# Altium schematic sheet TopLevel.SchDoc: Top Level
size A3; Organization: ORGANIZATION; Address1: ADDRESS 1; Address2: ADDRESS 2; Address3: ADDRESS 3; Address4: ADDRESS 4; Revision: -; SheetNumber: 1; SheetTotal: 11; ENG_APP_DATE: --/--/--; DSN_APP_DATE: --/--/--; CHK_APP_DATE: --/--/--
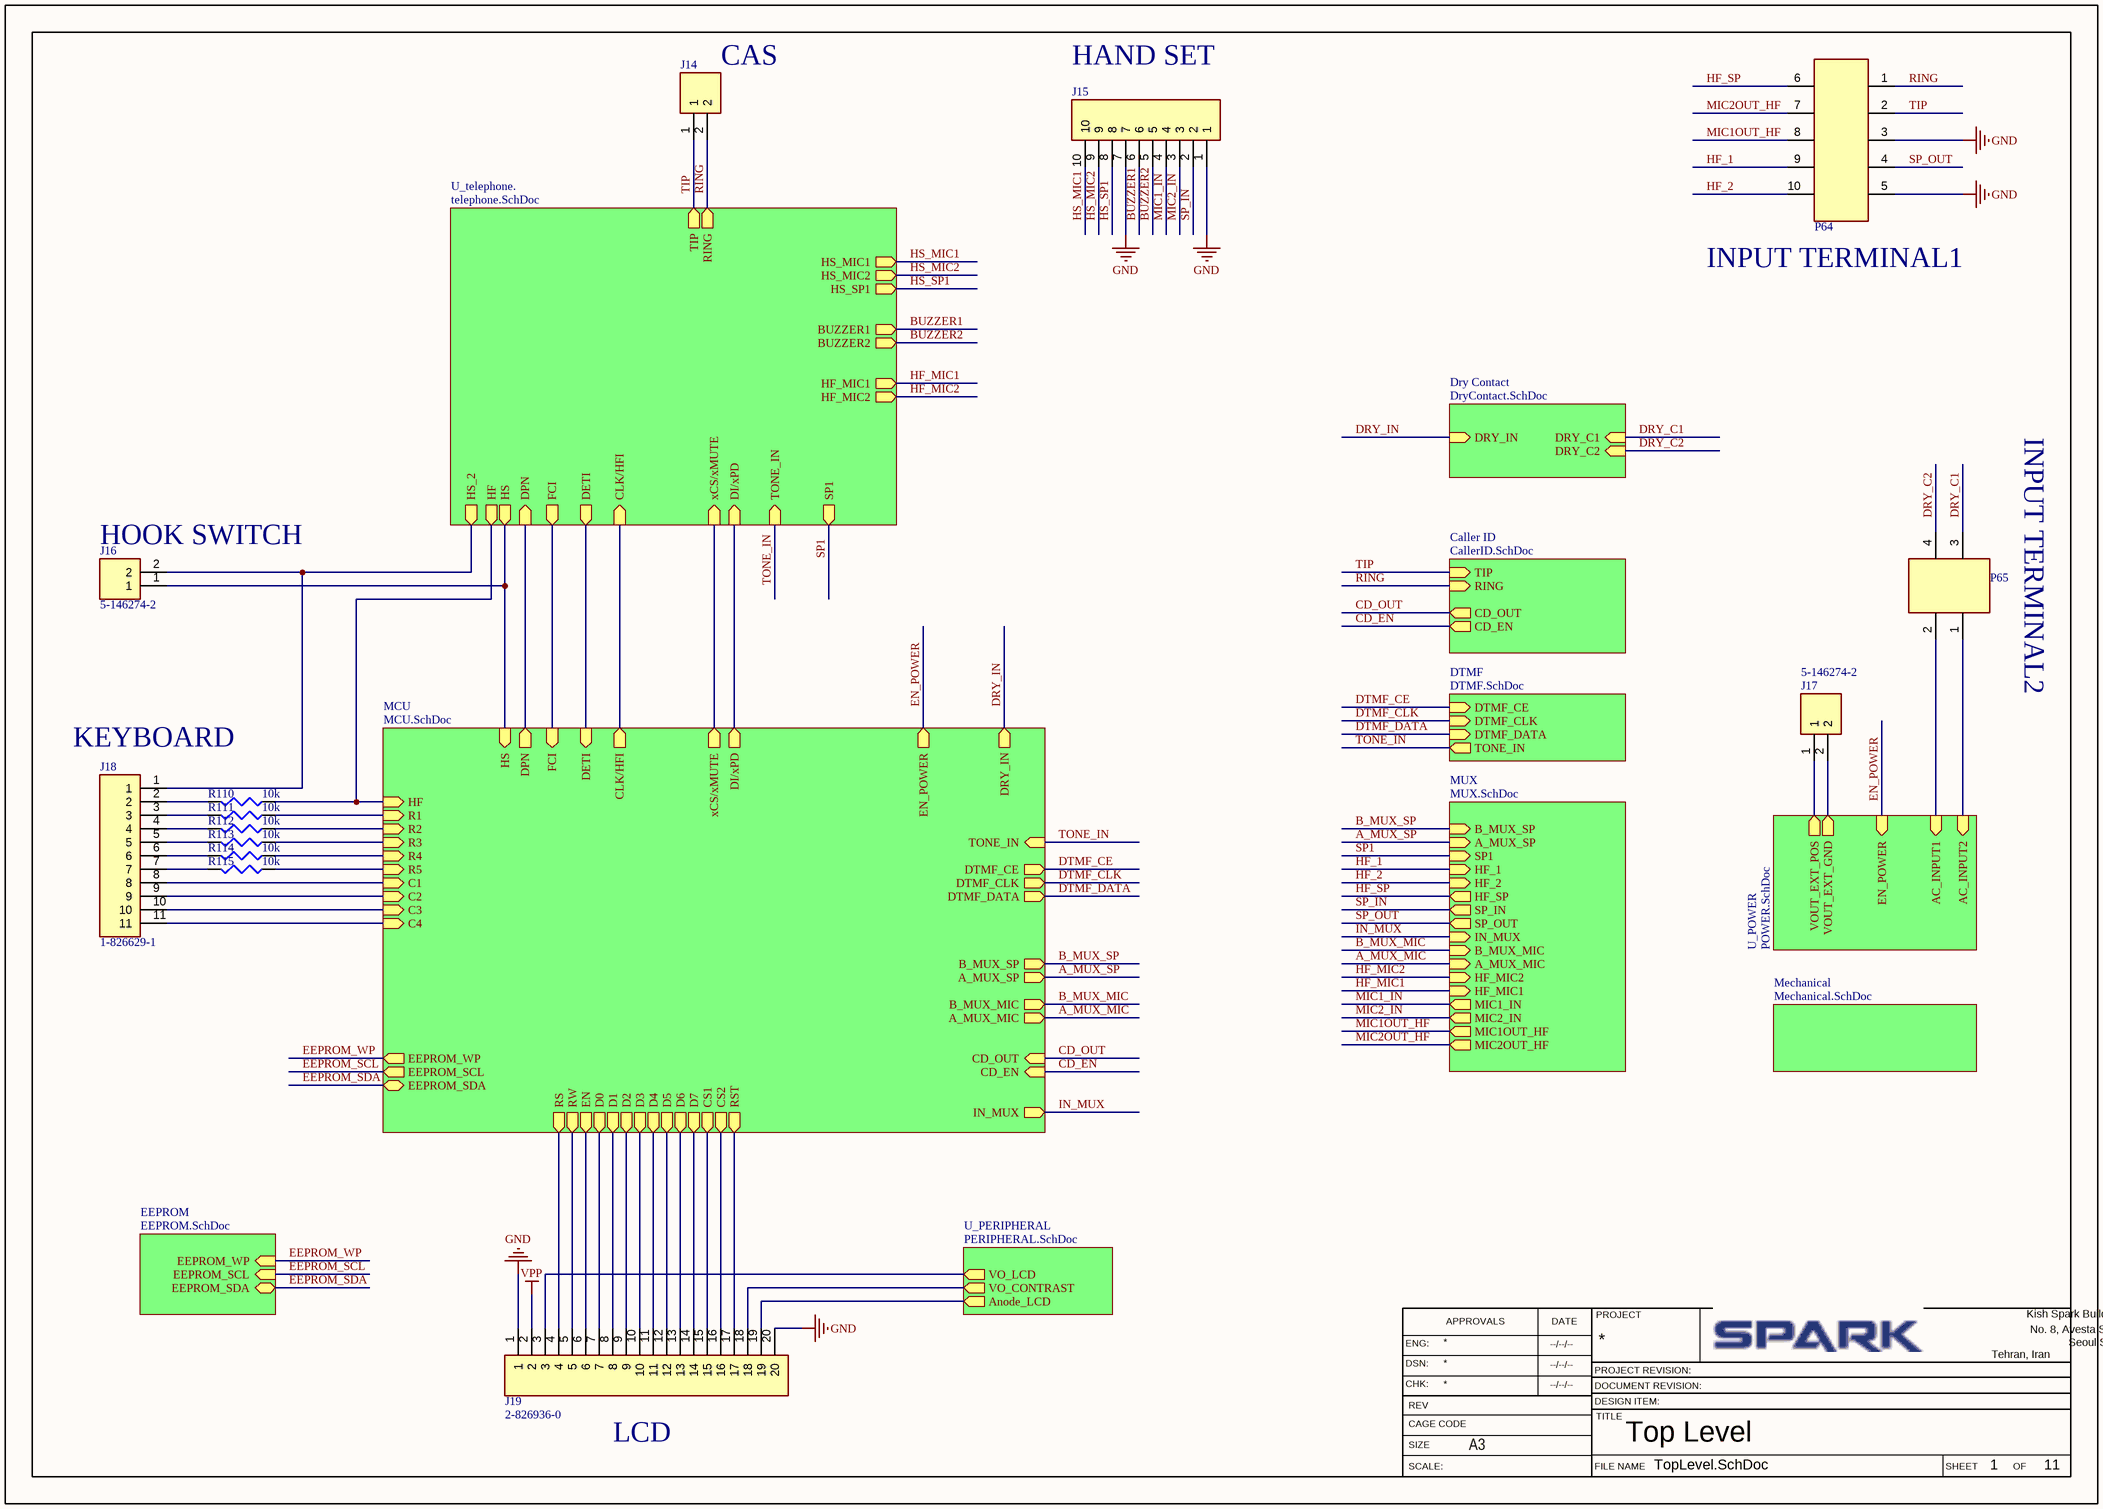
[diagram p0: TopLevel.SchDoc]

## Parts
J14  5-146274-2  [TE_5-146274-2]  (value not drawn)
J15  146443-5  [146443-5]  (value not drawn)
J16  5-146274-2  [TE_5-146274-2]
J17  5-146274-2  [TE_5-146274-2]
J18  1-826629-1  [1-826629-1]
J19  2-826936-0  [2-826936-0]
P64  66201021122  [POWER 10 PIN]  (value not drawn)
P65  66200421122  [power-4pin]  (value not drawn)
R110  value 10k  [R0603]  (hidden comment: CRCW060310K0JNEA)
R111  value 10k  [R0603]  (hidden comment: CRCW060310K0JNEA)
R112  value 10k  [R0603]  (hidden comment: CRCW060310K0JNEA)
R113  value 10k  [R0603]  (hidden comment: CRCW060310K0JNEA)
R114  value 10k  [R0603]  (hidden comment: CRCW060310K0JNEA)
R115  value 10k  [R0603]  (hidden comment: CRCW060310K0JNEA)

## Sub-sheets
Caller ID = CallerID.SchDoc: CD_OUT (out), TIP (in), RING (in), CD_EN (out)
Dry Contact = DryContact.SchDoc: DRY_C2 (in), DRY_C1 (in), DRY_IN (in)
DTMF = DTMF.SchDoc: DTMF_CE (in), DTMF_CLK (in), DTMF_DATA (in), TONE_IN (out)
EEPROM = EEPROM.SchDoc: EEPROM_WP (in), EEPROM_SCL (in), EEPROM_SDA (bidir)
MCU = MCU.SchDoc: DI/xPD (out), xCS/xMUTE (out), DPN (out), CLK/HFI (out), DETI (in), DTMF_CE (out), DTMF_CLK (out), DTMF_DATA (out), TONE_IN (in), R1 (in), R2 (in), R3 (in), R4 (in), R5 (in), C1 (in), C2 (in), C3 (in), C4 (in), HF (in), HS (in), FCI (in), B_MUX_SP (out), A_MUX_SP (out), B_MUX_MIC (out), A_MUX_MIC (out), CD_EN (in), CD_OUT (in), CS2 (out), D4 (out), D5 (out), EN (out), D6 (out), D2 (out), CS1 (out), D3 (out), D1 (out), RS (out), D0 (out), RST (out), D7 (out), RW (out), DRY_IN (out), EN_POWER (out), IN_MUX (out), EEPROM_WP (out), EEPROM_SCL (out), EEPROM_SDA (bidir)
Mechanical = Mechanical.SchDoc: no entries
MUX = MUX.SchDoc: B_MUX_SP (in), A_MUX_SP (in), SP1 (in), HF_1 (in), HF_2 (in), HF_SP (out), SP_IN (out), SP_OUT (out), IN_MUX (in), B_MUX_MIC (in), A_MUX_MIC (in), HF_MIC2 (in), HF_MIC1 (in), MIC1_IN (out), MIC2_IN (out), MIC1OUT_HF (out), MIC2OUT_HF (out)
U_PERIPHERAL = PERIPHERAL.SchDoc: VO_LCD (out), VO_CONTRAST (out), Anode_LCD (out)
U_POWER = POWER.SchDoc: EN_POWER (in), VOUT_EXT_POS (out), AC_INPUT1 (in), AC_INPUT2 (in), VOUT_EXT_GND (out)
U_telephone. = telephone.SchDoc: HF (out), HS (out), DI/xPD (in), xCS/xMUTE (in), DPN (in), FCI (out), TONE_IN (in), DETI (out), CLK/HFI (in), TIP (out), RING (out), SP1 (out), HS_SP1 (out), HS_2 (out), BUZZER1 (out), BUZZER2 (out), HF_MIC2 (out), HF_MIC1 (out), HS_MIC1 (out), HS_MIC2 (out)

## Nets
GND: J15.1 J15.7 J19.1 J19.20 P64.3 P64.5
VPP: J19.2
A_MUX_MIC: sheet MCU/A_MUX_MIC, sheet MUX/A_MUX_MIC
A_MUX_SP: sheet MCU/A_MUX_SP, sheet MUX/A_MUX_SP
B_MUX_MIC: sheet MCU/B_MUX_MIC, sheet MUX/B_MUX_MIC
B_MUX_SP: sheet MCU/B_MUX_SP, sheet MUX/B_MUX_SP
BUZZER1: J15.6 ; sheet U_telephone./BUZZER1
BUZZER2: J15.5 ; sheet U_telephone./BUZZER2
CD_EN: sheet MCU/CD_EN, sheet Caller ID/CD_EN
CD_OUT: sheet MCU/CD_OUT, sheet Caller ID/CD_OUT
DRY_C1: P65.3 ; sheet Dry Contact/DRY_C1
DRY_C2: P65.4 ; sheet Dry Contact/DRY_C2
DRY_IN: sheet Dry Contact/DRY_IN, sheet MCU/DRY_IN
DTMF_CE: sheet MCU/DTMF_CE, sheet DTMF/DTMF_CE
DTMF_CLK: sheet MCU/DTMF_CLK, sheet DTMF/DTMF_CLK
DTMF_DATA: sheet MCU/DTMF_DATA, sheet DTMF/DTMF_DATA
EEPROM_SCL: sheet MCU/EEPROM_SCL, sheet EEPROM/EEPROM_SCL
EEPROM_SDA: sheet MCU/EEPROM_SDA, sheet EEPROM/EEPROM_SDA
EEPROM_WP: sheet MCU/EEPROM_WP, sheet EEPROM/EEPROM_WP
EN_POWER: sheet MCU/EN_POWER, sheet U_POWER/EN_POWER
HF_1: P64.9 ; sheet MUX/HF_1
HF_2: P64.10 ; sheet MUX/HF_2
HF_MIC1: sheet U_telephone./HF_MIC1, sheet MUX/HF_MIC1
HF_MIC2: sheet U_telephone./HF_MIC2, sheet MUX/HF_MIC2
HF_SP: P64.6 ; sheet MUX/HF_SP
HS_MIC1: J15.10 ; sheet U_telephone./HS_MIC1
HS_MIC2: J15.9 ; sheet U_telephone./HS_MIC2
HS_SP1: J15.8 ; sheet U_telephone./HS_SP1
IN_MUX: sheet MCU/IN_MUX, sheet MUX/IN_MUX
MIC1_IN: J15.4 ; sheet MUX/MIC1_IN
MIC1OUT_HF: P64.8 ; sheet MUX/MIC1OUT_HF
MIC2_IN: J15.3 ; sheet MUX/MIC2_IN
MIC2OUT_HF: P64.7 ; sheet MUX/MIC2OUT_HF
RING: J14.2 P64.1 ; sheet U_telephone./RING, sheet Caller ID/RING
SP1: sheet U_telephone./SP1, sheet MUX/SP1
SP_IN: J15.2 ; sheet MUX/SP_IN
SP_OUT: P64.4 ; sheet MUX/SP_OUT
TIP: J14.1 P64.2 ; sheet U_telephone./TIP, sheet Caller ID/TIP
TONE_IN: sheet U_telephone./TONE_IN, sheet MCU/TONE_IN, sheet DTMF/TONE_IN
NetJ16_1: J16.1 ; sheet U_telephone./HS, sheet MCU/HS
NetJ16_2: J16.2 J18.1 ; sheet U_telephone./HS_2
NetJ17_1: J17.1 ; sheet U_POWER/VOUT_EXT_POS
NetJ17_2: J17.2 ; sheet U_POWER/VOUT_EXT_GND
NetJ18_2: J18.2 R110.2
NetJ18_3: J18.3 R111.2
NetJ18_4: J18.4 R112.2
NetJ18_5: J18.5 R113.2
NetJ18_6: J18.6 R114.2
NetJ18_7: J18.7 R115.2
NetJ18_8: J18.8 ; sheet MCU/C1
NetJ18_9: J18.9 ; sheet MCU/C2
NetJ18_10: J18.10 ; sheet MCU/C3
NetJ18_11: J18.11 ; sheet MCU/C4
NetJ19_3: J19.3 ; sheet U_PERIPHERAL/VO_LCD
NetJ19_4: J19.4 ; sheet MCU/RS
NetJ19_5: J19.5 ; sheet MCU/RW
NetJ19_6: J19.6 ; sheet MCU/EN
NetJ19_7: J19.7 ; sheet MCU/D0
NetJ19_8: J19.8 ; sheet MCU/D1
NetJ19_9: J19.9 ; sheet MCU/D2
NetJ19_10: J19.10 ; sheet MCU/D3
NetJ19_11: J19.11 ; sheet MCU/D4
NetJ19_12: J19.12 ; sheet MCU/D5
NetJ19_13: J19.13 ; sheet MCU/D6
NetJ19_14: J19.14 ; sheet MCU/D7
NetJ19_15: J19.15 ; sheet MCU/CS1
NetJ19_16: J19.16 ; sheet MCU/CS2
NetJ19_17: J19.17 ; sheet MCU/RST
NetJ19_18: J19.18 ; sheet U_PERIPHERAL/VO_CONTRAST
NetJ19_19: J19.19 ; sheet U_PERIPHERAL/Anode_LCD
NetP65_1: P65.1 ; sheet U_POWER/AC_INPUT2
NetP65_2: P65.2 ; sheet U_POWER/AC_INPUT1
NetR110_1: R110.1 ; sheet U_telephone./HF, sheet MCU/HF
NetR111_1: R111.1 ; sheet MCU/R1
NetR112_1: R112.1 ; sheet MCU/R2
NetR113_1: R113.1 ; sheet MCU/R3
NetR114_1: R114.1 ; sheet MCU/R4
NetR115_1: R115.1 ; sheet MCU/R5
(unnamed): sheet U_telephone./DI/xPD, sheet MCU/DI/xPD
(unnamed): sheet U_telephone./xCS/xMUTE, sheet MCU/xCS/xMUTE
(unnamed): sheet U_telephone./DPN, sheet MCU/DPN
(unnamed): sheet U_telephone./FCI, sheet MCU/FCI
(unnamed): sheet U_telephone./DETI, sheet MCU/DETI
(unnamed): sheet U_telephone./CLK/HFI, sheet MCU/CLK/HFI

## Notes on the sheet
- (near J14) CAS
- HAND SET
- (near P64) INPUT TERMINAL1
- INPUT TERMINAL2
- (near J16) HOOK SWITCH
- (near J18) KEYBOARD
- LCD
- APPROVALS
- DATE
- PROJECT
- Kish Spark Building
- No. 8, Avesta Street
- ENG:
- DSN:
- CHK:
- PROJECT REVISION:
- DESIGN ITEM:
- DOCUMENT REVISION:
- Tehran, Iran
- Seoul Street, Sheikh Bahaie
- SIZE
- REV
- SCALE:
- CAGE CODE
- A3
- FILE NAME
- TITLE
- SHEET
- OF

## Library data of the parts
J14 J16 J17 = CMP-002-00181-1: Conn Unshrouded Header HDR 2 POS 2.54mm Solder ST Top Entry Thru-Hole Carton; Connector Type: Plug,Header,Pin; Gender: Male; Voltage Rating: 750V; Approvals: CSA; Board Standoff: Yes (With); Contact Current Rating: 3A; Contact Post Length: 0.125inch; Contact Protection: No (Without); High Speed Serial Data Connector: No; High Temperature Housing: Yes; Max Voltage Rating (AC): 250V; Number of Contacts: 2; PCB Mount Retention: Without; PCB Mounting Orientation: Vertical; PCB Thickness: 0.062inch; Max Operating Temperature: 105°C; Min Operating Temperature: -65°C; Mounting Technology: Through Hole; RoHS Compliant: Yes; Color: Black; Contact Finish - Mating: TIN; Contact Gender: Male; Contact Material: Bronze; Contact Mating Length: 8.08mm; Contact Plating: Tin; Contact Shape: Square; Contact Type: Male Pin; Current Rating: 3A; Depth: 2.34mm; ELV: Compliant; Fastening Type: Pull; Flammability Rating: UL94 V-0; Gasket: No (Without); Housing Color: Black; Housing Material: Polymer; Insulation Color: Black; Insulation Material: Polymer; Keyed: No; Lead Free: Lead Free; Length: 2.67mm; Mating Alignment: No (Without); Mating Connector Lock: No (Without); Number of Positions: 2; Number of Rows: 1; Orientation: Straight; Package Quantity: 500; Packaging: Carton; Pitch: 2.54mm; Radiation Hardening: No; Reach SVHC Compliant: Unknown; Row Spacing: 2.54mm; Selectively Loaded: No (Without); Series: AMPMODU MOD II; Stabilizers: No (Without); Strain Relief: No (Without); Termination: Through Hole
J15 = CMP-002-00182-1: Conn Unshrouded Header HDR 10 POS 2.54mm Solder ST Thru-Hole Carton; Connector Type: Plug,Header,Pin; Board Standoff: No (Without); High Speed Serial Data Connector: No; Number of Contacts: 10; PCB Mount Retention: Without; PCB Mounting Orientation: Vertical; Plating Thickness: 5um; Mounting Technology: Surface Mount; RoHS Compliant: No; Contact Finish - Mating: GOLD; Contact Material: Copper Alloy; Contact Mating Length: 0.23inch; Contact Plating: Gold; Contact Protection: No (Without); Contact Shape: Square; Contact Type: Male Pin; ELV: Non-Compliant; Fastening Type: Pull; Gasket: No (Without); High Temperature Compatible: No; High Temperature Housing: No; Housing Color: Black; Housing Material: Thermoplastic; Keyed: No; Mating Alignment: No (Without); Mating Connector Lock: No (Without); Number of Positions: 10; Number of Rows: 2; Orientation: Vertical; Package Quantity: 320; Packaging: Carton; Pitch: 2.54mm; Radiation Hardening: No; Row Spacing: 2.54mm; Sealable: No (Without); Selectively Loaded: No (Without); Series: AMPMODU MOD II; Stabilizers: No (Without); Strain Relief: No (Without); Termination: SMD/SMT
J18 = CMP-002-00184-1: Conn Unshrouded Header HDR 11 POS 2.54mm Solder ST Thru-Hole Carton; Connector Type: Plug,Header,Pin; Board Standoff: No (Without); Contact Post Length: 0.1259inch; High Speed Serial Data Connector: No; Number of Contacts: 11; PCB Mount Retention: Without; PCB Mounting Orientation: Vertical; Plating Thickness: 0.8um; Max Operating Temperature: 105°C; Min Operating Temperature: -65°C; Mounting Technology: Straddle Mount; RoHS Compliant: Yes; Contact Finish - Mating: GOLD; Contact Gender: Male; Contact Material: Bronze; Contact Mating Length: 6.7mm; Contact Plating: Gold,Tin; Contact Protection: No (Without); Contact Shape: Square; Contact Type: Male Pin; ELV: Compliant; Fastening Type: Pull; Flammability Rating: UL94 V-0; Gasket: No (Without); High Temperature Housing: No; Housing Color: Green; Housing Material: PBT; Insulation Color: Green; Insulation Material: PBT; Keyed: No; Mating Alignment: No (Without); Mating Connector Lock: No (Without); Number of Positions: 11; Number of Rows: 1; Orientation: Straight; Package Quantity: 500; Packaging: Carton; Pitch: 2.54mm; Radiation Hardening: No; Row Spacing: 2.54mm; Selectively Loaded: No (Without); Series: AMPMODU MOD II; Stabilizers: No (Without); Strain Relief: No (Without); Termination: Through Hole
J19 = CMP-002-00183-1: Conn Unshrouded Header HDR 20 POS 2.54mm Solder ST Thru-Hole Box; Connector Type: Plug,Header,Pin; Board Standoff: No (Without); Contact Current Rating: 5A; Contact Post Length: 0.1259inch; High Speed Serial Data Connector: No; Number of Contacts: 20; PCB Mount Retention: Without; PCB Mounting Orientation: Vertical; Plating Thickness: 2um; Max Operating Temperature: 105°C; Min Operating Temperature: -65°C; Mounting Technology: Through Hole; RoHS Compliant: Yes; Color: Green; Contact Gender: Male; Contact Material: Bronze; Contact Mating Length: 5.8mm; Contact Plating: Tin; Contact Protection: No (Without); Contact Shape: Square; Contact Type: Male Pin; ELV: Compliant; Flammability Rating: UL94 V-0; Gasket: No (Without); High Temperature Housing: No; Housing Color: Green; Housing Material: PBT; Keyed: No; Mating Alignment: No (Without); Mating Connector Lock: No (Without); Number of Positions: 20; Number of Rows: 1; Package Quantity: 300; Packaging: Box; Pitch: 2.54mm; Radiation Hardening: No; Row Spacing: 2.54mm; Selectively Loaded: No (Without); Series: AMPMODU MOD II; Stabilizers: No (Without); Strain Relief: No (Without); Termination: Through Hole
P64 = CMP-002-00178-2: WR-MPC3; 3mm Pitch 10 Way 2 Row Shrouded Straight PCB Header; Through Hole; Manufacturer: Wurth Electronics; Current Rating: 5A; Voltage Rating: 250V; Number of Positions: 10; Insulation: Insulated; Insulation Resistance: 1GR; Gender: Receptacle; Manufacturer Part Number: 66201021122; Category: Headers and Wire Housings; Mounting Technology: Through Hole; Color: Black; Contact Material: Copper Alloy,Copper; Contact Plating: Tin; Housing Material: Nylon; Contact Shape: Square; Contact Finish - Mating: TIN; Insulation Material: Polymer; Insulation Color: Black; Min Operating Temperature: -25°C; Max Operating Temperature: 105°C; Number of Rows: 2; Fastening Type: Ramp; Packaging: Tray; Contact Gender: Male; Termination: Through Hole; Number of Contacts: 10; Connector Type: Header; Series: WR-MPC3; Contact Type: Male Pin; Length: 18.7mm; Width: 18.7mm; Height: 9.9mm; Pitch: 3mm; Flammability Rating: UL94 V-0; RoHS Compliant: Yes; Reach SVHC Compliant: Unknown; ComponentLink1URL: https://datasheet.ciiva.com/8043/624425-8043421.pdf?src-supplier=Element14; ComponentLink1Description: https://datasheet.ciiva.com/8043/624425-8043421.pdf?src-supplier=Element14; ComponentLink2URL: https://datasheet.ciiva.com/731/6620xx21122-731332.pdf?src-supplier=Digi-Key; ComponentLink2Description: https://datasheet.ciiva.com/731/6620xx21122-731332.pdf?src-supplier=Digi-Key; Pins: 10; Component Type: Standard
P65 = CMP-002-00177-2: WR-MPC3 Series; 3mm Pitch 4 Way 2 Row Shrouded Straight PCB Header; Through Hole; Manufacturer: Wurth Electronics; Current Rating: 5A; Voltage Rating: 250V; Number of Positions: 4; Insulation: Insulated; Insulation Resistance: 1GR; Gender: Receptacle; Row Spacing: 0.118inch; Manufacturer Part Number: 66200421122; Category: Headers and Wire Housings; Mounting Technology: Through Hole; Color: Black; Contact Material: Copper Alloy,Copper; Contact Plating: Tin; Housing Material: Nylon; Contact Shape: Square; Contact Finish - Mating: TIN; Insulation Material: Polymer; Insulation Color: Black; Min Operating Temperature: -25°C; Max Operating Temperature: 105°C; Number of Rows: 2; Fastening Type: Ramp; Packaging: Tray; Contact Gender: Male; Termination: Through Hole; Number of Contacts: 4; Connector Type: Header; Series: WR-MPC3; Contact Type: Male Pin; Length: 9.7mm; Width: 9.7mm; Height: 9.9mm; Pitch: 3mm; Flammability Rating: UL94 V-0; RoHS Compliant: Yes; Reach SVHC Compliant: Unknown; ComponentLink1URL: https://datasheet.ciiva.com/8043/624425-8043413.pdf?src-supplier=Element14; ComponentLink1Description: https://datasheet.ciiva.com/8043/624425-8043413.pdf?src-supplier=Element14; ComponentLink2URL: https://datasheet.ciiva.com/731/6620xx21122-731329.pdf?src-supplier=Digi-Key; ComponentLink2Description: https://datasheet.ciiva.com/731/6620xx21122-731329.pdf?src-supplier=Digi-Key; Case/Package: 63; Pins: 4; Design Item ID: 66200421122; Component Type: Standard
R110-R115 = CMP-009-00213-1: Res Thick Film 0603 10K Ohm 5% 1/10W 200ppm/C Molded SMD SMD Paper T/R; Manufacturer 1: Vishay Dale; Voltage Rating: 75V; Max Power Dissipation: 100mW; Temperature Coefficient: 200ppm/°C; Case/Package: 0603; Pins: 2; RoHS Compliant: Yes; Min Operating Temperature: -55°C; Max Operating Temperature: 155°C; Tolerance: 5%; Design Item ID: CRCW060310K0JNEA; Case Code (Metric): 1608; Category: Chip SMD Resistors; Construction: Rectangular; Contact Plating: Tin; Depth: 0.85mm; Features: Automotive AEC-Q200; Height: 0.02inch; Lead Free: Lead Free; Length: 1.55mm; Manufacturer Part Number 1: CRCW060310K0JNEA; Military Standard: Not; Mount: Surface Mount; Number of Terminations: 2; Package Quantity: 1; Packaging: Tape and Reel; Power Rating: 100mW; Pricing 1: 1=0.10000, 10=0.03300, 100=0.01360, 1000=0.00610, 2500=0.00529 (USD); Radiation Hardening: No; REACH SVHC: Unknown; Resistance Tolerance: 5%; Resistor Type: Thick Film; RoHS: Yes; Series: CRCW; Size Code: 0603; Source: PTZLib.SchLib; Stock 1: 41; Termination: SMD/SMT; Voltage Rating (DC): 75V; Weight: 7.1E-05oz; Width: 0.033inch; ComponentLink1Description: https://datasheet.ciiva.com/3256/dcrcwe3-3256943.pdf?src-supplier=Avnet; ComponentLink1URL: https://datasheet.ciiva.com/3256/dcrcwe3-3256943.pdf?src-supplier=Avnet; ComponentLink2Description: https://datasheet.ciiva.com/2461/dcrcwe3-2461971.pdf?src-supplier=Digi-Key; ComponentLink2URL: https://datasheet.ciiva.com/2461/dcrcwe3-2461971.pdf?src-supplier=Digi-Key; ComponentLink3Description: https://datasheet.ciiva.com/2461/dcrcwe3-2461972.pdf?src-supplier=Digi-Key; ComponentLink3URL: https://datasheet.ciiva.com/2461/dcrcwe3-2461972.pdf?src-supplier=Digi-Key; ComponentLink4Description: https://datasheet.ciiva.com/2461/dcrcwe3-2461973.pdf?src-supplier=Digi-Key; ComponentLink4URL: https://datasheet.ciiva.com/2461/dcrcwe3-2461973.pdf?src-supplier=Digi-Key; ComponentLink5Description: https://datasheet.ciiva.com/3256/dcrcwe3-3256942.pdf?src-supplier=Avnet; ComponentLink5URL: https://datasheet.ciiva.com/3256/dcrcwe3-3256942.pdf?src-supplier=Avnet; ComponentLink6Description: https://datasheet.ciiva.com/16343/dcrcwe3-16343525.pdf?src-supplier=Future+Electronics; ComponentLink6URL: https://datasheet.ciiva.com/16343/dcrcwe3-16343525.pdf?src-supplier=Future+Electronics; ComponentLink7Description: https://datasheet.ciiva.com/16755/70201119-16755717.pdf?src-supplier=Allied+Electronics; ComponentLink7URL: https://datasheet.ciiva.com/16755/70201119-16755717.pdf?src-supplier=Allied+Electronics; ComponentLink8Description: https://datasheet.ciiva.com/16515/dcrcwe3-16515020.pdf?src-supplier=Avnet+Asia; ComponentLink8URL: https://datasheet.ciiva.com/16515/dcrcwe3-16515020.pdf?src-supplier=Avnet+Asia; ComponentLink9Description: https://datasheet.ciiva.com/16771/70201119-16771051.pdf?src-supplier=Allied+Electronics; ComponentLink9URL: https://datasheet.ciiva.com/16771/70201119-16771051.pdf?src-supplier=Allied+Electronics